# Altium project BEAGLEBONEBLACK_REV A5B.PrjPcb (part 6 of 6)

## Sheet P10_HDMI Framer.SchDoc
size 386 x 246 mm
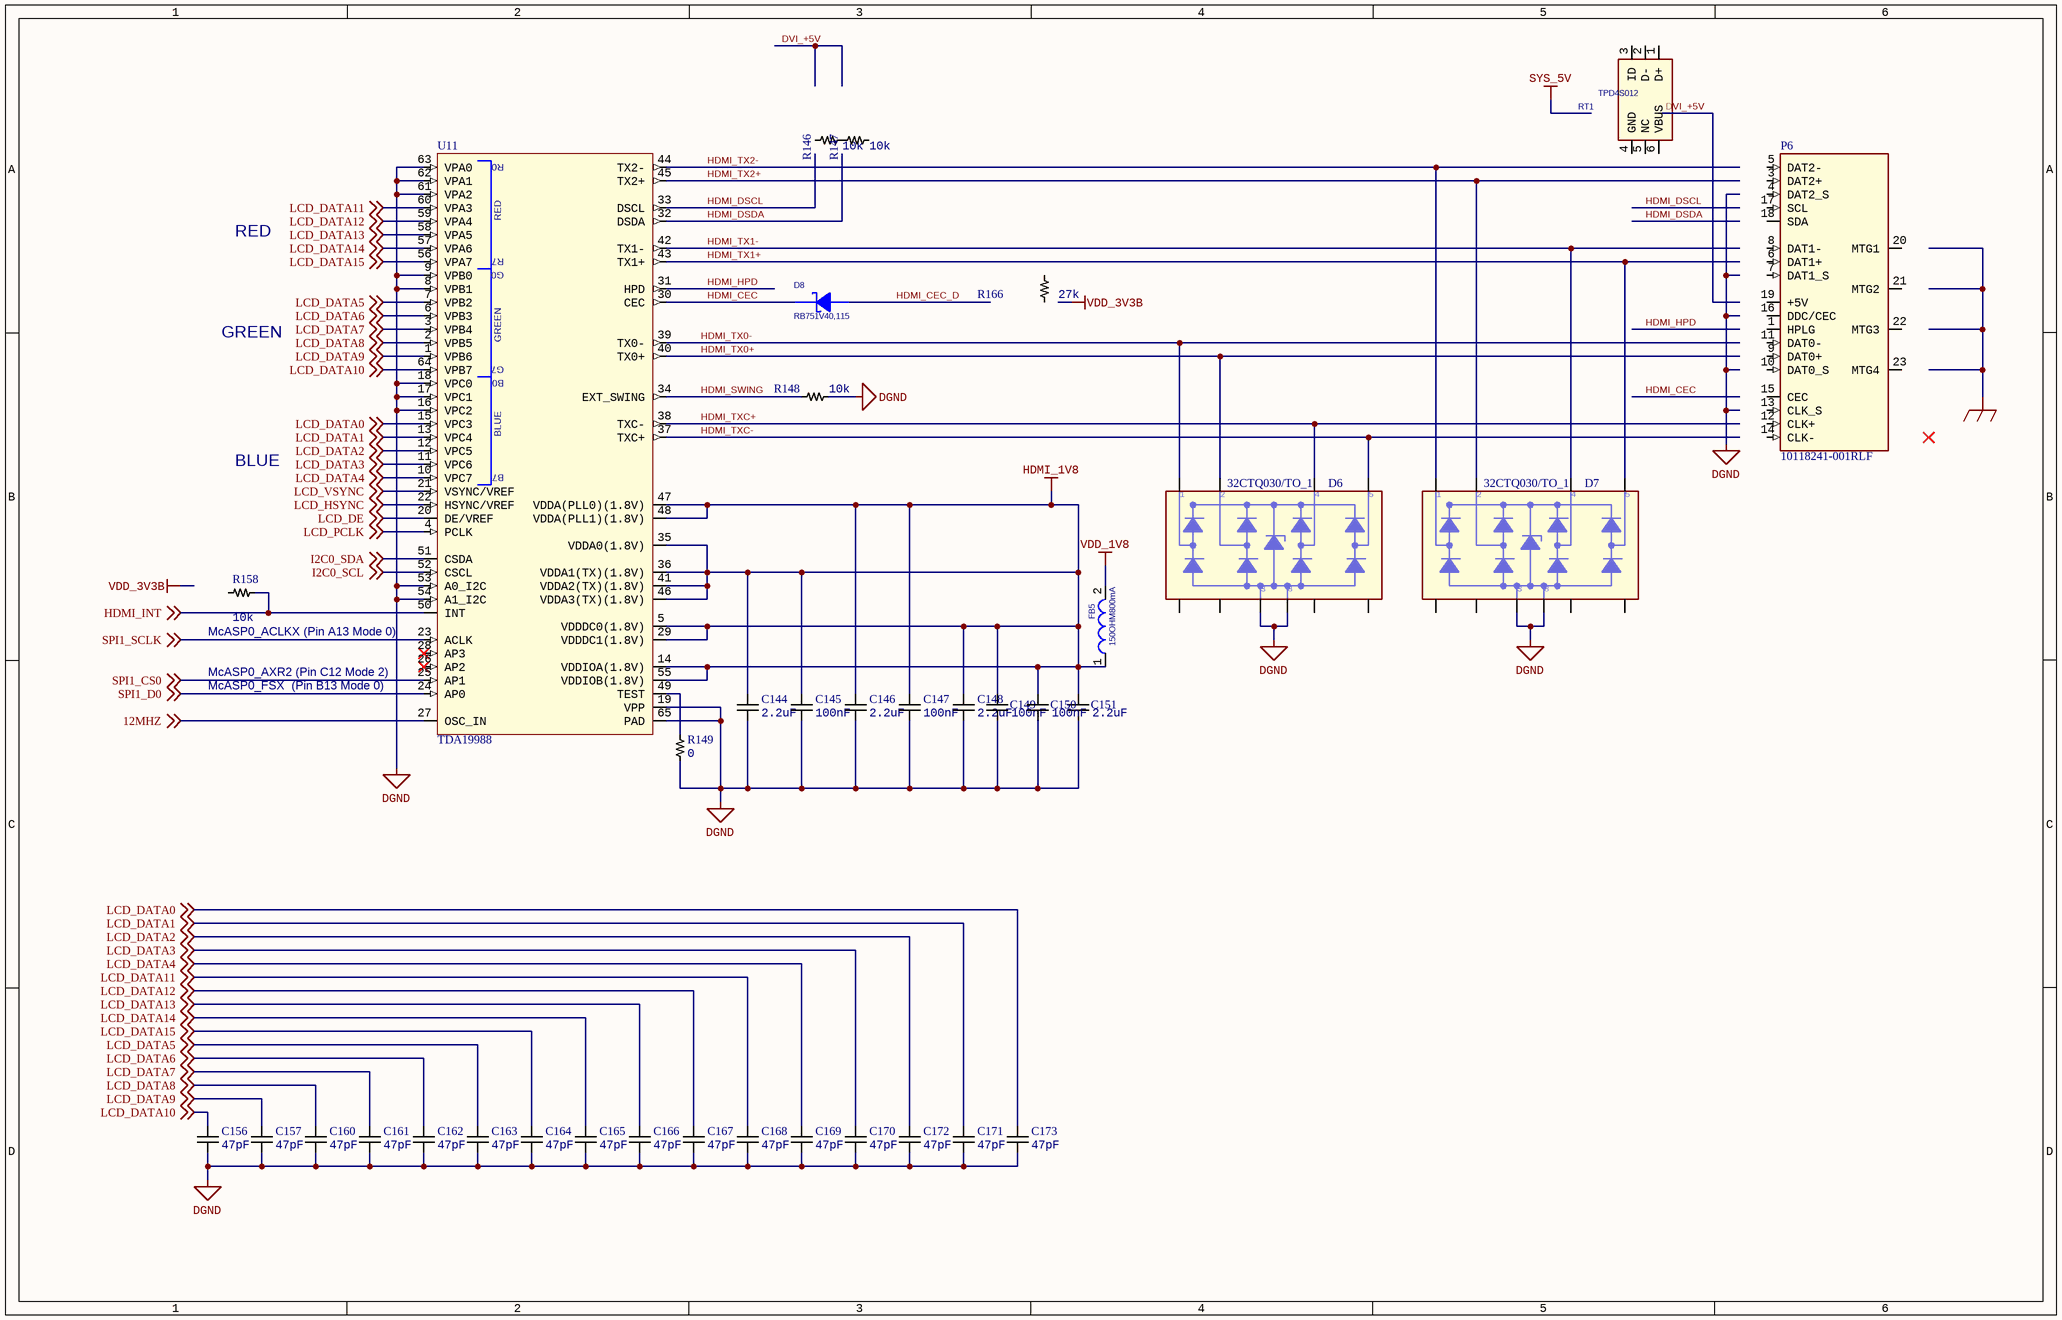
[diagram p8: P10_HDMI Framer.SchDoc]

### Parts
(Parts that share a designator on the sheet are numbered #1, #2 ... from top to bottom, then left to right.)
C144#1  Capacitance: 2.2uF  [CAP0402]  (hidden comment: C1005X5R0J225K050BC)
C145#1  Capacitance: 100nF  [CAP0402]  (hidden comment: C0402C104K4RACTU)
C146#1  Capacitance: 2.2uF  [CAP0402]  (hidden comment: C1005X5R0J225K050BC)
C147  Capacitance: 100nF  [CAP0402]  (hidden comment: C0402C104K4RACTU)
C148  Capacitance: 2.2uF  [CAP0402]  (hidden comment: C1005X5R0J225K050BC)
C149  Capacitance: 100nF  [CAP0402]  (hidden comment: C0402C104K4RACTU)
C150  Capacitance: 100nF  [CAP0402]  (hidden comment: C0402C104K4RACTU)
C151  Capacitance: 2.2uF  [CAP0402]  (hidden comment: C1005X5R0J225K050BC)
C156  Capacitance: 47pF  [CAP0402]  (hidden comment: CC0402JRNPO9BN470)
C157  Capacitance: 47pF  [CAP0402]  (hidden comment: CC0402JRNPO9BN470)
C160  Capacitance: 47pF  [CAP0402]  (hidden comment: CC0402JRNPO9BN470)
C161  Capacitance: 47pF  [CAP0402]  (hidden comment: CC0402JRNPO9BN470)
C162  Capacitance: 47pF  [CAP0402]  (hidden comment: CC0402JRNPO9BN470)
C163  Capacitance: 47pF  [CAP0402]  (hidden comment: CC0402JRNPO9BN470)
C164  Capacitance: 47pF  [CAP0402]  (hidden comment: CC0402JRNPO9BN470)
C165  Capacitance: 47pF  [CAP0402]  (hidden comment: CC0402JRNPO9BN470)
C166  Capacitance: 47pF  [CAP0402]  (hidden comment: CC0402JRNPO9BN470)
C167  Capacitance: 47pF  [CAP0402]  (hidden comment: CC0402JRNPO9BN470)
C168  Capacitance: 47pF  [CAP0402]  (hidden comment: CC0402JRNPO9BN470)
C169  Capacitance: 47pF  [CAP0402]  (hidden comment: CC0402JRNPO9BN470)
C170  Capacitance: 47pF  [CAP0402]  (hidden comment: CC0402JRNPO9BN470)
C171  Capacitance: 47pF  [CAP0402]  (hidden comment: CC0402JRNPO9BN470)
C172  Capacitance: 47pF  [CAP0402]  (hidden comment: CC0402JRNPO9BN470)
C173  Capacitance: 47pF  [CAP0402]  (hidden comment: CC0402JRNPO9BN470)
D6  32CTQ030/TO_1  [TSSOP10]
D7  32CTQ030/TO_1  [TSSOP10]
D8  RB751V40,115  [SOD323]
FB5  150OHM800mA  [FB0805]
P6#1  10118241-001RLF  [CONN19_HDMI]
R146  Resistance: 10k  [RES0402]  (hidden comment: RC0402FR-0710KL)
R147  Resistance: 10k  [RES0402]  (hidden comment: RC0402FR-0710KL)
R148  Resistance: 10k  [RES0402]  (hidden comment: RC0402FR-0710KL)
R149  Resistance: 0  [RES0402]  (hidden comment: RC0402JR-070RL)
R158  Resistance: 10k  [RES0402]  (hidden comment: RC0402FR-0710KL)
R166  Resistance: 27k  [RES0402]  (hidden comment: RC0402FR-0727KL)
RT1  TPD4S012  [U_6_DRY]
U11  TDA19988  [HVQFN-64]

### Nets
DGND: C144#1.2 C145#1.2 C146#1.2 C147.2 C148.2 C149.2 C150.2 C151.2 C156.2 C157.2 C160.2 C161.2 C162.2 C163.2 C164.2 C165.2 C166.2 C167.2 C168.2 C169.2 C170.2 C171.2 C172.2 C173.2 D6.3 D6.8 D7.3 D7.8 R148.2 R149.2 U11.8(VPB1) U11.9(VPB0) U11.16(VPC2) U11.17(VPC1) U11.18(VPC0) U11.19(VPP) U11.53(A0_I2C) U11.54(A1_I2C) U11.61(VPA2) U11.62(VPA1) U11.63(VPA0) U11.65(PAD)
HDMI_1V8: C144#1.1 C145#1.1 C146#1.1 C147.1 C148.1 C149.1 C150.1 C151.1 FB5.1 U11.5(VDDDC0(1.8V)) U11.14(VDDIOA(1.8V)) U11.29(VDDDC1(1.8V)) U11.35(VDDA0(1.8V)) U11.36(VDDA1(TX)(1.8V)) U11.41(VDDA2(TX)(1.8V)) U11.46(VDDA3(TX)(1.8V)) U11.47(VDDA(PLL0)(1.8V)) U11.48(VDDA(PLL1)(1.8V)) U11.55(VDDIOB(1.8V))
VDD_1V8: FB5.2
12MHZ: U11.27(OSC_IN) ; off-sheet 12MHZ
HDMI_CEC: D8.1(C) U11.30(CEC)
HDMI_CEC_D: D8.2(A)
HDMI_DSCL: U11.33(DSCL)
HDMI_DSDA: U11.32(DSDA)
HDMI_HPD: U11.31(HPD)
HDMI_INT: R158.2 U11.50(INT) ; off-sheet HDMI_INT
HDMI_SWING: R148.1 U11.34(EXT_SWING)
HDMI_TX0+: D6.2 U11.40(TX0+)
HDMI_TX0-: D6.1 U11.39(TX0-)
HDMI_TX1+: D7.5 U11.43(TX1+)
HDMI_TX1-: D7.4 U11.42(TX1-)
HDMI_TX2+: D7.2 U11.45(TX2+)
HDMI_TX2-: D7.1 U11.44(TX2-)
HDMI_TXC+: D6.4 U11.38(TXC-)
HDMI_TXC-: D6.5 U11.37(TXC+)
I2C0_SCL: U11.52(CSCL) ; off-sheet I2C0_SCL
I2C0_SDA: U11.51(CSDA) ; off-sheet I2C0_SDA
LCD_DATA0: C173.1 U11.15(VPC3) ; off-sheet LCD_DATA0  [project net SYS_BOOT0]
LCD_DATA1: C171.1 U11.13(VPC4) ; off-sheet LCD_DATA1  [project net SYS_BOOT1]
LCD_DATA2: C172.1 U11.12(VPC5) ; off-sheet LCD_DATA2  [project net SYS_BOOT2]
LCD_DATA3: C170.1 U11.11(VPC6) ; off-sheet LCD_DATA3  [project net SYS_BOOT3]
LCD_DATA4: C169.1 U11.10(VPC7) ; off-sheet LCD_DATA4  [project net SYS_BOOT4]
LCD_DATA5: C163.1 U11.7(VPB2) ; off-sheet LCD_DATA5  [project net SYS_BOOT5]
LCD_DATA6: C162.1 U11.6(VPB3) ; off-sheet LCD_DATA6  [project net SYS_BOOT6]
LCD_DATA7: C161.1 U11.3(VPB4) ; off-sheet LCD_DATA7  [project net SYS_BOOT7]
LCD_DATA8: C160.1 U11.2(VPB5) ; off-sheet LCD_DATA8  [project net SYS_BOOT8]
LCD_DATA9: C157.1 U11.1(VPB6) ; off-sheet LCD_DATA9  [project net SYS_BOOT9]
LCD_DATA10: C156.1 U11.64(VPB7) ; off-sheet LCD_DATA10  [project net SYS_BOOT10]
LCD_DATA11: C168.1 U11.60(VPA3) ; off-sheet LCD_DATA11  [project net SYS_BOOT11]
LCD_DATA12: C167.1 U11.59(VPA4) ; off-sheet LCD_DATA12  [project net SYS_BOOT12]
LCD_DATA13: C166.1 U11.58(VPA5) ; off-sheet LCD_DATA13  [project net SYS_BOOT13]
LCD_DATA14: C165.1 U11.57(VPA6) ; off-sheet LCD_DATA14  [project net SYS_BOOT14]
LCD_DATA15: C164.1 U11.56(VPA7) ; off-sheet LCD_DATA15  [project net SYS_BOOT15]
LCD_DE: U11.20(DE/VREF) ; off-sheet LCD_DE
LCD_HSYNC: U11.22(HSYNC/VREF) ; off-sheet LCD_HSYNC
LCD_PCLK: U11.4(PCLK) ; off-sheet LCD_PCLK
LCD_VSYNC: U11.21(VSYNC/VREF) ; off-sheet LCD_VSYNC
SPI1_CS0: U11.25(AP1) ; off-sheet SPI1_CS0
SPI1_D0: U11.24(AP0) ; off-sheet SPI1_D0
SPI1_SCLK: U11.23(ACLK) ; off-sheet SPI1_SCLK
NetR146_1: R146.1 R147.2
NetR149_1: R149.1 U11.49(TEST)

Not connected (* = marked no-connect by the designer): D6 6 7 9 10; D7 6 7 9 10; P6#1 1(HPLG) 3(DAT2+) 4(DAT2_S) 5(DAT2-) 6(DAT1+) 7(DAT1_S) 8(DAT1-) 9(DAT0+) 10(DAT0_S) 11(DAT0-) 12(CLK+) 13(CLK_S) 14(CLK-) 15(CEC) 16(DDC/CEC) 17(SCL) 18(SDA) 19(+5V) 20(MTG1) 21(MTG2) 22(MTG3) 23(MTG4); R146 2; R147 1; R158 1; R166 1 2; RT1 1(D+) 2(D-) 3(ID) 4(GND) 5(NC) 6(VBUS); U11 26(AP2)* 28(AP3)*

### Notes on the sheet
- RED
- GREEN
- BLUE
- McASP0_ACLKX (Pin A13 Mode 0)
- McASP0_AXR2 (Pin C12 Mode 2)
- McASP0_FSX  (Pin B13 Mode 0)
- (in symbol TDA19988) R0; RED; R7; G0; GREEN; G7; B0; BLUE; B7

### Library data of the parts
C144#1 C146#1 C148 C151 = CAP_2.2uF: MLCC 2.2uF 0402 SMD; Manufacturer: TDK; Dielectric Material: Ceramic; Tolerance: 10%; Dielectric: X5R; Voltage Rating: 6.3V; Supplier 1: Digi-Key; Manufacturer Part Number: C1005X5R0J225K050BC; Stock 1: 256055; Pricing 1: 1=0.20000, 10=0.13800, 100=0.07010, 500=0.04794, 1000=0.04240, 2500=0.04056, 5000=0.03687 (USD); RoHS: Yes; Mount: Surface Mount; Case/Package: 0402; Number of Pins: 2; Weight: 2.3E-05oz; Case Code (Metric): 1005; Case Code (Imperial): 0402; Min Operating Temperature: -55°C; Max Operating Temperature: 85°C; Packaging: Tape and Reel; Voltage Rating (DC): 6.3V; Termination: SMD/SMT; Package Quantity: 1; Composition: Ceramic; Voltage: 6.3V; Length: 1mm; Height: 0.5mm; Width: 0.02inch; Depth: 0.5mm; Thickness: 0.022inch; Radiation Hardening: No; Lead Free: Lead Free; REACH SVHC: No SVHC; ComponentLink7Description: Datasheet; ComponentLink7URL: https://product.tdk.com/info/en/catalog/datasheets/mlcc_commercial_general_en.pdf?ref_disty=digikey
C145#1 C147 C149 C150 = CAP_100nF: as C107-C117 on sheet P07_DDR3 Memory; Supplier 1: Digi-Key; Manufacturer Part Number: C0402C104K4RACTU; Stock 1: 6512243; Pricing 1: 1=0.10000, 10=0.04200, 100=0.01860, 500=0.01328, 1000=0.01044, 2500=0.00949, 5000=0.00873 (USD); RoHS: Yes; Mount: Surface Mount; Case/Package: 0402; Case Code (Imperial): 0402; Case Code (Metric): 1005; Contact Plating: Tin,Matte; Min Operating Temperature: -55°C; Max Operating Temperature: 125°C; Packaging: Tape and Reel; Package Quantity: 10000; Voltage Rating: 16V; Termination: SMD/SMT; Length: 1mm; Height: 0.5mm; Width: 0.5mm; Depth: 0.5mm; Radiation Hardening: No; ComponentLink2URL: https://datasheet.ciiva.com/18192/getdatasheetpartid-385384-18192412.pdf?src-supplier=Verical; ComponentLink2Description: Datasheet; Supplier Part Number 1: 399-3521-1-ND
C156 C157 C160-C173 = CAP_47pF: MLCC 47pF 0402 SMD; Manufacturer: Yageo; Dielectric Material: Ceramic; Tolerance: 5%; Dielectric: C0G; Voltage: 50V; Insulation Resistance: 100GR; Supplier 1: Digi-Key; Manufacturer Part Number: CC0402JRNPO9BN470; Stock 1: 2538955; Pricing 1: 1=0.10000, 10=0.02100, 100=0.00940, 500=0.00668, 1000=0.00525, 2500=0.00478, 5000=0.00439 (USD); RoHS: Yes; Mount: Surface Mount; Case/Package: 0402; Number of Pins: 2; Weight: 2.3E-05oz; Case Code (Metric): 1005; Case Code (Imperial): 0402; Min Operating Temperature: -55°C; Max Operating Temperature: 125°C; Voltage Rating: 50V; Package Quantity: 1; Packaging: Tape and Reel; Voltage Rating (DC): 50V; Termination: SMD/SMT; Composition: Ceramic; Length: 1mm; Height: 0.5mm; Depth: 0.5mm; Width: 0.02inch; Thickness: 0.022inch; Radiation Hardening: No; REACH SVHC: No SVHC; Lead Free: Lead Free; ComponentLink1URL: https://datasheet.ciiva.com/161/mlccorderingcode-161492.pdf?src-supplier=Digi-Key; ComponentLink1Description: https://datasheet.ciiva.com/161/mlccorderingcode-161492.pdf?src-supplier=Digi-Key; ComponentLink2URL: https://datasheet.ciiva.com/161/mlccorderingcode-161493.pdf?src-supplier=Digi-Key; ComponentLink2Description: https://datasheet.ciiva.com/161/mlccorderingcode-161493.pdf?src-supplier=Digi-Key; ComponentLink3URL: https://datasheet.ciiva.com/8033/1443161-8033637.pdf?src-supplier=Element14; ComponentLink3Description: https://datasheet.ciiva.com/8033/1443161-8033637.pdf?src-supplier=Element14; ComponentLink4URL: https://datasheet.ciiva.com/161/mlccorderingcode-161494.pdf?src-supplier=Digi-Key; ComponentLink4Description: https://datasheet.ciiva.com/161/mlccorderingcode-161494.pdf?src-supplier=Digi-Key; ComponentLink5URL: https://datasheet.ciiva.com/8033/1443161-8033638.pdf?src-supplier=Element14; ComponentLink5Description: https://datasheet.ciiva.com/8033/1443161-8033638.pdf?src-supplier=Element14; ComponentLink6URL: https://datasheet.ciiva.com/17437/upy-gp-np0-16v-to-50v-8-17437546.pdf?src-supplier=Avnet+Europe; ComponentLink6Description: https://datasheet.ciiva.com/17437/upy-gp-np0-16v-to-50v-8-17437546.pdf?src-supplier=Avnet+Europe; ComponentLink7URL: https://datasheet.ciiva.com/28450/1443161-28450267.pdf?src-supplier=Element14; ComponentLink7Description: https://datasheet.ciiva.com/28450/1443161-28450267.pdf?src-supplier=Element14
D8 = Zener: DIODE SCHOTTKY 40V 120MA SOD323; Manufacturer: NXP Semiconductors; Current - Average Rectified (Io): 120mA (DC); Voltage - Forward (Vf) (Max) @ If: 370mV @ 1mA; Speed: Small Signal =< 200mA (Io), Any Speed; Current - Reverse Leakage @ Vr: 500nA @ 30V; Capacitance @ Vr, F: 2pF @ 1V, 1MHz; Supplier 1: Digi-Key; Supplier Part Number 1: 568-8119-6-ND; Manufacturer Part Number: RB751V40,115; RoHS: RoHS Compliant; Category: Discrete Semiconductor Products; Stock 1: 5326; Pricing 1: 1=0.29, 10=0.26, 25=0.1872, 100=0.1456, 250=0.09152, 500=0.07798, 1000=0.05313 (USD); Diode Type: Schottky; Voltage - DC Reverse (Vr) (Max): 40V; Reverse Recovery Time (trr): -; Mounting Type: Surface Mount; Package / Case: SC-76, SOD-323; Supplier Device Package: SOD-323; Packaging: Digi-Reel®; ComponentLink1URL: http://www.nxp.com/documents/data_sheet/RB751_SER.pdf; ComponentLink1Description: http://www.nxp.com/documents/data_sheet/RB751_SER.pdf
FB5 = IND: FERRITE 800MA 150 OHM 0805 SMD; Manufacturer: Laird-Signal Integrity Products; Manufacturer Part Number: LI0805H151R-10; Impedance @ Frequency: 150 Ohm @ 100MHz; DC Resistance (DCR): 150 mOhm Max; Filter Type: Differential Mode - Single; Supplier 1: Digi-Key; Supplier Part Number 1: 240-2384-6-ND; RoHS: RoHS Compliant; Category: Filters; Stock 1: 10144; Pricing 1: 1=0.1, 10=0.07, 25=0.064, 50=0.0574, 100=0.0421, 250=0.03064, 500=0.02808, 1000=0.02424 (USD); Current Rating: 800mA; Package / Case: 0805 (2012 Metric); Mounting Type: Surface Mount; Packaging: Digi-Reel®; Height (Max): 0.043" (1.10mm); Size / Dimension: 0.079" L x 0.049" W (2.00mm x 1.25mm); ComponentLink1URL: http://www.lairdtech.com/WorkArea/linkit.aspx?LinkIdentifier=id&ItemID=4912; ComponentLink1Description: http://www.lairdtech.com/WorkArea/linkit.aspx?LinkIdentifier=id&ItemID=4912
P6#1 = Micro HDMI: CONN HDMI RECPT 19POS SMT R/A; Manufacturer: FCI; Number of Contacts: 19; Gender: Receptacle; Supplier 1: Digi-Key; Supplier Part Number 1: 609-4615-6-ND; Manufacturer Part Number: 10118241-001RLF; RoHS: RoHS Compliant; Category: Connectors, Interconnects; Stock 1: 6779; Pricing 1: 1=1.34, 10=1.174, 25=1.1052, 50=1.059, 100=1.013, 250=0.92092 (USD); Connector Type: HDMI; Specifications: -; Mounting Type: Surface Mount, Right Angle, Horizontal; Features: Shielded, Solder Retention; Packaging: Digi-Reel®; Ingress Protection: -; ComponentLink1URL: http://portal.fciconnect.com/Comergent//fci/drawing/10118241.pdf; ComponentLink1Description: http://portal.fciconnect.com/Comergent//fci/drawing/10118241.pdf
R146-R148 R158 = RES_10k: Resistor 10kOhm 0402 SMD; Manufacturer: Yageo; Temperature Coefficient: 100ppm/°C; Tolerance: 1%; Voltage Rating (DC): 50V; Power Rating: 62.5mW; Supplier 1: Digi-Key; Manufacturer Part Number: RC0402FR-0710KL; RoHS: Yes; Stock 1: 72891652; Pricing 1: 1=0.10000, 10=0.01500, 100=0.00600, 1000=0.00270, 2500=0.00235, 5000=0.00194 (USD); Composition: Thick Film; Height: 0.32mm; Number of Terminations: 2; Packaging: Tape and Reel; ComponentLink1URL: https://datasheet.ciiva.com/7660/38568-7660787.pdf?src-supplier=Element14; ComponentLink1Description: https://datasheet.ciiva.com/7660/38568-7660787.pdf?src-supplier=Element14; Case/Package: 0402; Number of Pins: 2; Case Code (Imperial): 0402; Case Code (Metric): 1005; Min Operating Temperature: -55°C; Max Operating Temperature: 155°C; Voltage Rating: 50V; Termination: SMD/SMT; Military Standard: Not; Working Voltage: 50V; Length: 1mm; Width: 0.5mm; Depth: 0.5mm; Lead Pitch: 0.2mm; REACH SVHC: No SVHC; Lead Free: Lead Free; ComponentLink2URL: https://datasheet.ciiva.com/7983/1018594-7983486.pdf?src-supplier=Element14; ComponentLink2Description: https://datasheet.ciiva.com/7983/1018594-7983486.pdf?src-supplier=Element14; ComponentLink3URL: https://datasheet.ciiva.com/7849/1784430-7849813.pdf?src-supplier=Element14; ComponentLink3Description: https://datasheet.ciiva.com/7849/1784430-7849813.pdf?src-supplier=Element14; ComponentLink4URL: https://datasheet.ciiva.com/7849/1686128-7849814.pdf?src-supplier=Element14; ComponentLink4Description: https://datasheet.ciiva.com/7849/1686128-7849814.pdf?src-supplier=Element14; ComponentLink5URL: https://datasheet.ciiva.com/7849/1784430-7849815.pdf?src-supplier=Element14; ComponentLink5Description: https://datasheet.ciiva.com/7849/1784430-7849815.pdf?src-supplier=Element14; ComponentLink6URL: https://datasheet.ciiva.com/22747/1018594-22747512.pdf?src-supplier=Element14; ComponentLink6Description: https://datasheet.ciiva.com/22747/1018594-22747512.pdf?src-supplier=Element14; ComponentLink7URL: https://datasheet.ciiva.com/12667/pyu-rc0402-51-rohs-l-6-r-12667067.pdf?src-supplier=Mouser; ComponentLink7Description: https://datasheet.ciiva.com/12667/pyu-rc0402-51-rohs-l-6-r-12667067.pdf?src-supplier=Mouser
R149 = RES_0: Resistor 0Ohm 0402 SMD; Manufacturer: Yageo; Temperature Coefficient: 200ppm/°C; Tolerance: 5%; Power Rating: 62.5mW; Voltage Rating: 50V; Max Power Dissipation: 63mW; Supplier 1: Digi-Key; Supplier Part Number 1: 311-0.0JRCT-ND; Manufacturer Part Number: RC0402JR-070RL; RoHS: Yes; Stock 1: 68160806; Pricing 1: 1=0.10000, 10=0.01300, 25=0.00920, 50=0.00700, 100=0.00510, 250=0.00392, 500=0.00312, 1000=0.00230, 5000=0.00165 (USD); Composition: Thick Film; Features: Moisture Resistant; Height: 0.016inch; Number of Terminations: 2; Packaging: Tape and Reel; ComponentLink1URL: https://www.digikey.com/product-detail/en/yageo/RC0402JR-070RL/311-0.0JRCT-ND/729353; ComponentLink1Description: Digikey; Case/Package: 0402; Contact Plating: Tin,Matte; Case Code (Metric): 1005; Case Code (Imperial): 0402; Min Operating Temperature: -55°C; Max Operating Temperature: 155°C; Termination: SMD/SMT; Package Quantity: 1; Military Standard: Not; Length: 1mm; Width: 0.02inch; Depth: 0.5mm; Radiation Hardening: No; Lead Free: Lead Free; REACH SVHC: Unknown; ComponentLink2Description: Datasheet; ComponentLink2URL: https://www.yageo.com/upload/media/product/productsearch/datasheet/rchip/PYu-RC_Group_51_RoHS_L_10.pdf
R166 = RES_27k: Resistor 27kOhm 0402 SMD; Manufacturer: Yageo; Temperature Coefficient: 100ppm/°C; Tolerance: 1%; Power Rating: 63mW; Voltage Rating: 50V; Supplier 1: Digi-Key; Manufacturer Part Number: RC0402FR-0727KL; RoHS: Yes; Stock 1: 2429807; Pricing 1: 1=0.10000, 10=0.01600, 100=0.00640, 1000=0.00289, 2500=0.00251, 5000=0.00207 (USD); Composition: Thick Film; Features: Moisture Resistant; Height: 0.016inch; Number of Terminations: 2; Packaging: Tape and Reel; ComponentLink1URL: https://datasheet.ciiva.com/11819/0900766b80c66297-11819497.pdf?src-supplier=RSComponents; ComponentLink1Description: https://datasheet.ciiva.com/11819/0900766b80c66297-11819497.pdf?src-supplier=RSComponents; Case/Package: 0402; Case Code (Imperial): 0402; Case Code (Metric): 1005; Min Operating Temperature: -55°C; Max Operating Temperature: 155°C; Package Quantity: 10000; Termination: SMD/SMT; Military Standard: Not; Max Power Dissipation: 63mW; Length: 1mm; Width: 0.02inch; Depth: 0.5mm; REACH SVHC: Unknown; Lead Free: Lead Free; ComponentLink2URL: https://datasheet.ciiva.com/7849/1018594-7849925.pdf?src-supplier=Element14; ComponentLink2Description: https://datasheet.ciiva.com/7849/1018594-7849925.pdf?src-supplier=Element14; ComponentLink3URL: https://datasheet.ciiva.com/2453/pyu-r-int-thick-7-2453562.pdf?src-supplier=Digi-Key; ComponentLink3Description: https://datasheet.ciiva.com/2453/pyu-r-int-thick-7-2453562.pdf?src-supplier=Digi-Key; ComponentLink4URL: https://datasheet.ciiva.com/16772/pyu-rc0402-51-rohs-l-6-r-16772092.pdf?src-supplier=Future+Electronics; ComponentLink4Description: https://datasheet.ciiva.com/16772/pyu-rc0402-51-rohs-l-6-r-16772092.pdf?src-supplier=Future+Electronics
RT1 = PROT_TPD4S012: ESD 4channel USB Interface; Manufacturer: Texas Instruments; Manufacturer Part Number: TPD4S012DRYR; Mfr: TI; MfrNum: TPD4S012DRY; TIIntPartnumber: 1A0233; Vendor: Digikey; Cost100: 0.76; Cost10K: 0.23; Power (Watts): 60W; Number of Circuits: 4; Supplier 1: Digi-Key; Supplier Part Number 1: 296-24244-6-ND; RoHS: RoHS Compliant; Category: Circuit Protection; Stock 1: 7978; Pricing 1: 1=0.78, 10=0.682, 25=0.6028, 100=0.2552, 250=0.25044, 500=0.2457, 750=0.24097 (USD); Package / Case: 6-UFDFN; Packaging: Digi-Reel®; ComponentLink1URL: http://www.ti.com/lit/ds/symlink/tpd4s012.pdf; ComponentLink1Description: http://www.ti.com/lit/ds/symlink/tpd4s012.pdf; PartName: TPD4S012; Voltage - Working: -; Voltage - Clamping: -; Technology: Mixed Technology; Applications: USB; Supplier Device Package: 6-SON (1.45x1)
U11 = TDA19988: IC HDMI TRANSMITTER 64-HVQFN; Manufacturer: NXP Semiconductors; Manufacturer Part Number: TDA19988AHN/C1,551; Supplier 1: Digi-Key; Supplier Part Number 1: TDA19988AHN/C1,551-ND; RoHS: RoHS Compliant; Category: Integrated Circuits (ICs); Stock 1: 0; Pricing 1: 260=4.59 (USD); Type: HDMI Transmitter; Applications: Set-Top Boxes; Mounting Type: Surface Mount; Package / Case: 64-VFQFN Exposed Pad; Supplier Device Package: 64-HVQFN (9x9); Packaging: Tray; ComponentLink1Description: Digikey; ComponentLink1URL: https://www.digikey.com/product-detail/en/nxp-usa-inc/TDA19988BHN-C1557/568-12059-ND/2780352; ComponentLink2Description: Datasheet; ComponentLink2URL: https://media.digikey.com/pdf/Data%20Sheets/NXP%20PDFs/TDA19988_DS_21_july_2011.pdf

## Sheet P11_Exp Conn, uSD, and .SchDoc
size A
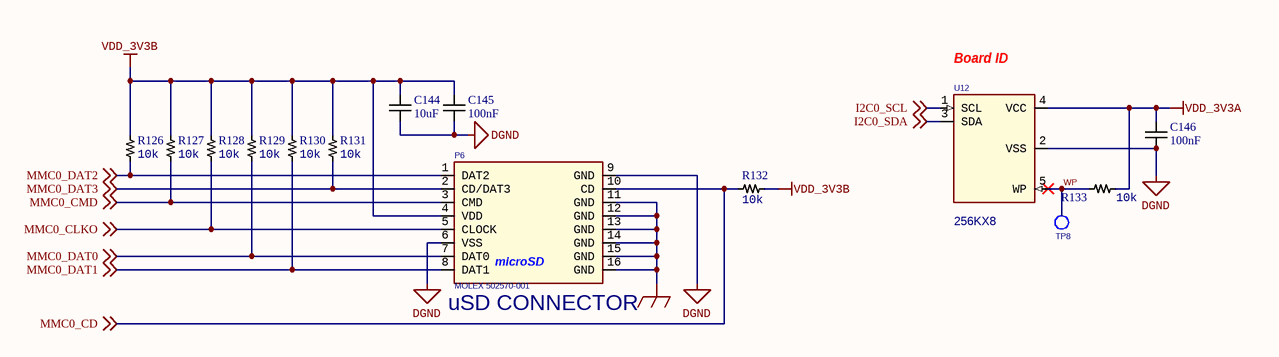
[diagram p9: P11_Exp Conn, uSD, and .SchDoc]

### Parts
(Parts that share a designator on the sheet are numbered #1, #2 ... from top to bottom, then left to right.)
C144#2  Capacitance: 10uF  [CAP0805]  (hidden comment: C2012X6S1A106K085AC)
C145#2  Capacitance: 100nF  [CAP0402]  (hidden comment: C0402C104K4RACTU)
C146#2  Capacitance: 100nF  [CAP0402]  (hidden comment: C0402C104K4RACTU)
P6#2  MOLEX 502570-001  [SD-MICRO-SCHA5B0300]
R126  Resistance: 10k  [RES0402]  (hidden comment: RC0402FR-0710KL)
R127  Resistance: 10k  [RES0402]  (hidden comment: RC0402FR-0710KL)
R128  Resistance: 10k  [RES0402]  (hidden comment: RC0402FR-0710KL)
R129  Resistance: 10k  [RES0402]  (hidden comment: RC0402FR-0710KL)
R130  Resistance: 10k  [RES0402]  (hidden comment: RC0402FR-0710KL)
R131  Resistance: 10k  [RES0402]  (hidden comment: RC0402FR-0710KL)
R132  Resistance: 10k  [RES0402]  (hidden comment: RC0402FR-0710KL)
R133  Resistance: 10k  [RES0402]  (hidden comment: RC0402FR-0710KL)
TP8#2  TESTPT1  [tp1-8040]  (value not drawn)  (no BOM)
U12#2  24LC32A  [SOT-23-5]  (value not drawn)

### Nets
DGND: C144#2.2 C145#2.2 C146#2.2 P6#2.6(VSS) P6#2.9(GND) U12#2.2(VSS)
GND_EARTH: P6#2.11(GND) P6#2.12(GND) P6#2.13(GND) P6#2.14(GND) P6#2.15(GND) P6#2.16(GND)
VDD_3V3A: C146#2.1 R133.2 U12#2.4(VCC)
VDD_3V3B: C144#2.1 C145#2.1 P6#2.4(VDD) R126.2 R127.2 R128.2 R129.2 R130.2 R131.2 R132.1
I2C0_SCL: U12#2.1(SCL) ; off-sheet I2C0_SCL
I2C0_SDA: U12#2.3(SDA) ; off-sheet I2C0_SDA
MMC0_CD: P6#2.10(CD) R132.2 ; off-sheet MMC0_CD
MMC0_CLKO: P6#2.5(CLOCK) R128.1 ; off-sheet MMC0_CLKO
MMC0_CMD: P6#2.3(CMD) R127.1 ; off-sheet MMC0_CMD
MMC0_DAT0: P6#2.7(DAT0) R129.1 ; off-sheet MMC0_DAT0
MMC0_DAT1: P6#2.8(DAT1) R130.1 ; off-sheet MMC0_DAT1
MMC0_DAT2: P6#2.1(DAT2) R126.1 ; off-sheet MMC0_DAT2
MMC0_DAT3: P6#2.2(CD/DAT3) R131.1 ; off-sheet MMC0_DAT3
WP: R133.1 TP8#2.1(TP) U12#2.5(WP)

### Notes on the sheet
- (near U12#2) Board ID
- (near U12#2) 256KX8
- (near P6#2) uSD CONNECTOR
- (in symbol microSD_CONN_2) microSD

### Library data of the parts
C144#2 = CAP_10uF: MLCC 10uF 0805 SMD; Manufacturer: TDK; Tolerance: 10%; Dielectric Material: Ceramic; Voltage Rating: 10V; Dielectric: X6S; Manufacturer Part Number: C2012X6S1A106K085AC; Packaging: Tape and Reel; Pricing 1: 1=0.30000, 10=0.20500, 100=0.11610, 500=0.08198, 1000=0.07173 (USD); RoHS: Yes; Stock 1: 46852; Supplier 1: Digi-Key; Supplier Part Number 1: 445-7613-1-ND; Mount: Surface Mount; Case/Package: 0805; Weight: 0.000194oz; Case Code (Metric): 2012; Case Code (Imperial): 0805; Min Operating Temperature: -55°C; Max Operating Temperature: 105°C; Termination: SMD/SMT; Package Quantity: 4000; Voltage Rating (DC): 10V; Composition: Ceramic; Length: 2mm; Height: 1.25mm; Depth: 1.25mm; Width: 0.049inch; Thickness: 0.037inch; REACH SVHC: No SVHC; Lead Free: Lead Free; ComponentLink3URL: https://datasheet.ciiva.com/6290/tdkmlcccaprange-6290501.pdf?src-supplier=Digi-Key; ComponentLink3Description: Datasheet
C145#2 C146#2 = CAP_100nF: as C107-C117 on sheet P07_DDR3 Memory; Supplier 1: Digi-Key; Supplier Part Number 1: 399-3521-1-ND; Manufacturer Part Number: C0402C104K4RACTU; RoHS: Yes; Stock 1: 6512243; Pricing 1: 1=0.10000, 10=0.04200, 100=0.01860, 500=0.01328, 1000=0.01044, 2500=0.00949, 5000=0.00873 (USD); Packaging: Tape and Reel; Mount: Surface Mount; Case/Package: 0402; Case Code (Imperial): 0402; Case Code (Metric): 1005; Contact Plating: Tin,Matte; Min Operating Temperature: -55°C; Max Operating Temperature: 125°C; Package Quantity: 10000; Voltage Rating: 16V; Termination: SMD/SMT; Length: 1mm; Height: 0.5mm; Width: 0.5mm; Depth: 0.5mm; Radiation Hardening: No; ComponentLink2URL: https://datasheet.ciiva.com/18192/getdatasheetpartid-385384-18192412.pdf?src-supplier=Verical; ComponentLink2Description: Datasheet
P6#2 = microSD_CONN_2: CONN MICRO SD R/A PUSH-PUSH SMD; Manufacturer: Molex Inc; Manufacturer Part Number: 5025700893; Card Type: Secure Digital - microSD™ TransFlash; Number of Positions: 10 (8 + 2); Connector Type: Connector and Ejector; Insertion, Removal Method: Push In, Push Out; Supplier 1: Digi-Key; Supplier Part Number 1: WM19093TR-ND; RoHS: RoHS Compliant; Category: Connectors, Interconnects; Stock 1: 16900; Pricing 1: 1300=2.16645, 2600=2.01703, 6500=1.94233 (USD); Ejector Side: -; Mounting Type: Surface Mount, Right Angle; Features: Switch; Height Above Board: 0.071" (1.80mm); Mounting Feature: Normal, Standard - Top; Packaging: Tape & Reel (TR); Contact Finish: Gold; Contact Finish Thickness: 20µin (0.51µm); ComponentLink1URL: http://www.molex.com/pdm_docs/sd/5025700893_sd.pdf; ComponentLink1Description: http://www.molex.com/pdm_docs/sd/5025700893_sd.pdf
R126-R133 = RES_10k: as R146 on sheet P10_HDMI Framer; ComponentLink1Description: https://datasheet.ciiva.com/7660/38568-7660787.pdf?src-supplier=Element14; ComponentLink1URL: https://datasheet.ciiva.com/7660/38568-7660787.pdf?src-supplier=Element14; Composition: Thick Film; Height: 0.32mm; Manufacturer Part Number: RC0402FR-0710KL; Number of Terminations: 2; Packaging: Tape and Reel; Pricing 1: 1=0.10000, 10=0.01500, 100=0.00600, 1000=0.00270, 2500=0.00235, 5000=0.00194 (USD); RoHS: Yes; Stock 1: 72891652; Supplier 1: Digi-Key; Case/Package: 0402; Number of Pins: 2; Case Code (Imperial): 0402; Case Code (Metric): 1005; Min Operating Temperature: -55°C; Max Operating Temperature: 155°C; Voltage Rating: 50V; Termination: SMD/SMT; Military Standard: Not; Working Voltage: 50V; Length: 1mm; Width: 0.5mm; Depth: 0.5mm; Lead Pitch: 0.2mm; REACH SVHC: No SVHC; Lead Free: Lead Free; ComponentLink2URL: https://datasheet.ciiva.com/7983/1018594-7983486.pdf?src-supplier=Element14; ComponentLink2Description: https://datasheet.ciiva.com/7983/1018594-7983486.pdf?src-supplier=Element14; ComponentLink3URL: https://datasheet.ciiva.com/7849/1784430-7849813.pdf?src-supplier=Element14; ComponentLink3Description: https://datasheet.ciiva.com/7849/1784430-7849813.pdf?src-supplier=Element14; ComponentLink4URL: https://datasheet.ciiva.com/7849/1686128-7849814.pdf?src-supplier=Element14; ComponentLink4Description: https://datasheet.ciiva.com/7849/1686128-7849814.pdf?src-supplier=Element14; ComponentLink5URL: https://datasheet.ciiva.com/7849/1784430-7849815.pdf?src-supplier=Element14; ComponentLink5Description: https://datasheet.ciiva.com/7849/1784430-7849815.pdf?src-supplier=Element14; ComponentLink6URL: https://datasheet.ciiva.com/22747/1018594-22747512.pdf?src-supplier=Element14; ComponentLink6Description: https://datasheet.ciiva.com/22747/1018594-22747512.pdf?src-supplier=Element14; ComponentLink7URL: https://datasheet.ciiva.com/12667/pyu-rc0402-51-rohs-l-6-r-12667067.pdf?src-supplier=Mouser; ComponentLink7Description: https://datasheet.ciiva.com/12667/pyu-rc0402-51-rohs-l-6-r-12667067.pdf?src-supplier=Mouser
U12#2 = 24LC32A: IC EEPROM 32KBIT 400KHZ SOT23-5; Manufacturer: Microchip Technology; Manufacturer Part Number: 24LC32AT-I/OT; Format - Memory: EEPROMs - Serial; Memory Size: 32K (4K x 8); Interface: I²C, 2-Wire Serial; Voltage - Supply: 2.5 V ~ 5.5 V; Supplier 1: Digi-Key; Supplier Part Number 1: 24LC32AT-I/OTDKR-ND; RoHS: RoHS Compliant; Category: Integrated Circuits (ICs); Stock 1: 8694; Pricing 1: 1=0.5, 10=0.32, 25=0.31, 100=0.3 (USD); Memory Type: EEPROM; Speed: 400kHz; Operating Temperature: -40°C ~ 85°C; Package / Case: SC-74A, SOT-753; Supplier Device Package: SOT-23-5; Packaging: Digi-Reel®; ComponentLink1URL: http://ww1.microchip.com/downloads/en/DeviceDoc/21713M.pdf; ComponentLink1Description: http://ww1.microchip.com/downloads/en/DeviceDoc/21713M.pdf

## Nets that join several sheets
DDR_VREF: P03_Processor 1 of 3, JTAG Header (C28.1 IC1.J4), P07_DDR3 Memory (6 pins)
DGND: P02_Power Management (31 pins), P03_Processor 1 of 3, JTAG Header (20 pins), P04_Processor 2 or 3, USB and Serial (17 pins), P05_Processor Page 3 of 3 (111 pins), P06_LED, Config, & Button (18 pins), P07_DDR3 Memory (42 pins), P08_eMMC (19 pins), P09_Ethernet (25 pins), P10_HDMI Framer (42 pins), P11_Exp Conn, uSD, and  (6 pins)
GND_EARTH: P02_Power Management (MTG1.1 MTG2.1 MTG3.1 MTG4.1), P04_Processor 2 or 3, USB and Serial (6 pins), P09_Ethernet (J7.13 J7.14 R92#2.1), P11_Exp Conn, uSD, and  (6 pins)
GNDA_ADC: P04_Processor 2 or 3, USB and Serial (C31.2 C32.2 C33.2 U5.A9), P05_Processor Page 3 of 3 (C93.2 FB3.1)
SYS_5V: P02_Power Management (14 pins), P04_Processor 2 or 3, USB and Serial (C17#2.1 U8.2 U8.3), P08_eMMC (C124#2.1 IC11.2 IC11.3)
USB_DC: P02_Power Management (C1.1 U2.12), P04_Processor 2 or 3, USB and Serial (C36.1 P4.1 R159.1 U10.6)
VDCDC2: P02_Power Management (C12.2 L2.2 U2.24), P05_Processor Page 3 of 3 (11 pins)
VDCDC3: P02_Power Management (C11.2 L3.2 U2.29), P05_Processor Page 3 of 3 (37 pins)
VDD_1V8: P02_Power Management (C14.2 R9.1 U2.40), P05_Processor Page 3 of 3 (9 pins), P10_HDMI Framer (FB5.2)
VDD_3V3A: P02_Power Management (5 pins), P03_Processor 1 of 3, JTAG Header (9 pins), P04_Processor 2 or 3, USB and Serial (R52.1), P05_Processor Page 3 of 3 (42 pins), P06_LED, Config, & Button (16 pins), P08_eMMC (R75#2.1), P11_Exp Conn, uSD, and  (C146#2.1 R133.2 U12#2.4)
VDD_3V3B: P02_Power Management (C20.1 R11.2 U4.3), P03_Processor 1 of 3, JTAG Header (C29.1 P2.5 R23.2 R24.1), P04_Processor 2 or 3, USB and Serial (C155.2 R163.2 U15.7 U15.8), P08_eMMC (25 pins), P09_Ethernet (7 pins), P11_Exp Conn, uSD, and  (10 pins)
VDD_ADC: P04_Processor 2 or 3, USB and Serial (R27.2), P05_Processor Page 3 of 3 (C93.1 FB2.1)
VDDS: P02_Power Management (R8.2 R9.2), P05_Processor Page 3 of 3 (13 pins)
VDDS_DDR: P02_Power Management (C9.2 R6.2), P05_Processor Page 3 of 3 (16 pins), P07_DDR3 Memory (36 pins)
VRTC: P02_Power Management (C16.2 R5.2), P04_Processor 2 or 3, USB and Serial (R26.2), P05_Processor Page 3 of 3 (C105.1)
12MHZ: P03_Processor 1 of 3, JTAG Header (R21.1), P10_HDMI Framer (U11.27)
DDR_A0: P03_Processor 1 of 3, JTAG Header (IC1.F3), P07_DDR3 Memory (U12#1.N3)
DDR_A1: P03_Processor 1 of 3, JTAG Header (IC1.H1), P07_DDR3 Memory (U12#1.P7)
DDR_A2: P03_Processor 1 of 3, JTAG Header (IC1.E4), P07_DDR3 Memory (U12#1.P3)
DDR_A3: P03_Processor 1 of 3, JTAG Header (IC1.C3), P07_DDR3 Memory (U12#1.N2)
DDR_A4: P03_Processor 1 of 3, JTAG Header (IC1.C2), P07_DDR3 Memory (U12#1.P8)
DDR_A5: P03_Processor 1 of 3, JTAG Header (IC1.B1), P07_DDR3 Memory (U12#1.P2)
DDR_A6: P03_Processor 1 of 3, JTAG Header (IC1.D5), P07_DDR3 Memory (U12#1.R8)
DDR_A7: P03_Processor 1 of 3, JTAG Header (IC1.E2), P07_DDR3 Memory (U12#1.R2)
DDR_A8: P03_Processor 1 of 3, JTAG Header (IC1.D4), P07_DDR3 Memory (U12#1.T8)
DDR_A9: P03_Processor 1 of 3, JTAG Header (IC1.C1), P07_DDR3 Memory (U12#1.R3)
DDR_A10: P03_Processor 1 of 3, JTAG Header (IC1.F4), P07_DDR3 Memory (U12#1.L7)
DDR_A11: P03_Processor 1 of 3, JTAG Header (IC1.F2), P07_DDR3 Memory (U12#1.R7)
DDR_A12: P03_Processor 1 of 3, JTAG Header (IC1.E3), P07_DDR3 Memory (U12#1.N7)
DDR_A13: P03_Processor 1 of 3, JTAG Header (IC1.H3), P07_DDR3 Memory (U12#1.T3)
DDR_A14: P03_Processor 1 of 3, JTAG Header (IC1.H4), P07_DDR3 Memory (U12#1.T7)
DDR_A15: P03_Processor 1 of 3, JTAG Header (IC1.D3), P07_DDR3 Memory (U12#1.M7)
DDR_BA0: P03_Processor 1 of 3, JTAG Header (IC1.C4), P07_DDR3 Memory (U12#1.M2)
DDR_BA1: P03_Processor 1 of 3, JTAG Header (IC1.E1), P07_DDR3 Memory (U12#1.N8)
DDR_BA2: P03_Processor 1 of 3, JTAG Header (IC1.B3), P07_DDR3 Memory (U12#1.M3)
DDR_CASn: P03_Processor 1 of 3, JTAG Header (IC1.F1), P07_DDR3 Memory (U12#1.K3)
DDR_CKE: P03_Processor 1 of 3, JTAG Header (IC1.G3), P07_DDR3 Memory (R96#1.1 U12#1.K9)
DDR_CLK: P03_Processor 1 of 3, JTAG Header (IC1.D2), P07_DDR3 Memory (U12#1.J7)
DDR_CLKn: P03_Processor 1 of 3, JTAG Header (IC1.D1), P07_DDR3 Memory (U12#1.K7)
DDR_CSn: P03_Processor 1 of 3, JTAG Header (IC1.H2), P07_DDR3 Memory (U12#1.L2)
DDR_D0: P03_Processor 1 of 3, JTAG Header (IC1.M3), P07_DDR3 Memory (U12#1.E3)
DDR_D1: P03_Processor 1 of 3, JTAG Header (IC1.M4), P07_DDR3 Memory (U12#1.F7)
DDR_D2: P03_Processor 1 of 3, JTAG Header (IC1.N1), P07_DDR3 Memory (U12#1.F2)
DDR_D3: P03_Processor 1 of 3, JTAG Header (IC1.N2), P07_DDR3 Memory (U12#1.F8)
DDR_D4: P03_Processor 1 of 3, JTAG Header (IC1.N3), P07_DDR3 Memory (U12#1.H3)
DDR_D5: P03_Processor 1 of 3, JTAG Header (IC1.N4), P07_DDR3 Memory (U12#1.H8)
DDR_D6: P03_Processor 1 of 3, JTAG Header (IC1.P3), P07_DDR3 Memory (U12#1.G2)
DDR_D7: P03_Processor 1 of 3, JTAG Header (IC1.P4), P07_DDR3 Memory (U12#1.H7)
DDR_D8: P03_Processor 1 of 3, JTAG Header (IC1.J1), P07_DDR3 Memory (U12#1.D7)
DDR_D9: P03_Processor 1 of 3, JTAG Header (IC1.K1), P07_DDR3 Memory (U12#1.C3)
DDR_D10: P03_Processor 1 of 3, JTAG Header (IC1.K2), P07_DDR3 Memory (U12#1.C8)
DDR_D11: P03_Processor 1 of 3, JTAG Header (IC1.K3), P07_DDR3 Memory (U12#1.C2)
DDR_D12: P03_Processor 1 of 3, JTAG Header (IC1.K4), P07_DDR3 Memory (U12#1.A7)
DDR_D13: P03_Processor 1 of 3, JTAG Header (IC1.L3), P07_DDR3 Memory (U12#1.A2)
DDR_D14: P03_Processor 1 of 3, JTAG Header (IC1.L4), P07_DDR3 Memory (U12#1.B8)
DDR_D15: P03_Processor 1 of 3, JTAG Header (IC1.M1), P07_DDR3 Memory (U12#1.A3)
DDR_DQM0: P03_Processor 1 of 3, JTAG Header (IC1.M2), P07_DDR3 Memory (U12#1.E7)
DDR_DQM1: P03_Processor 1 of 3, JTAG Header (IC1.J2), P07_DDR3 Memory (U12#1.D3)
DDR_DQS0: P03_Processor 1 of 3, JTAG Header (IC1.P1), P07_DDR3 Memory (U12#1.F3)
DDR_DQS1: P03_Processor 1 of 3, JTAG Header (IC1.L1), P07_DDR3 Memory (U12#1.C7)
DDR_DQSN0: P03_Processor 1 of 3, JTAG Header (IC1.P2), P07_DDR3 Memory (U12#1.G3)
DDR_DQSN1: P03_Processor 1 of 3, JTAG Header (IC1.L2), P07_DDR3 Memory (U12#1.B7)
DDR_ODT: P03_Processor 1 of 3, JTAG Header (IC1.G1), P07_DDR3 Memory (U12#1.K1)
DDR_RASn: P03_Processor 1 of 3, JTAG Header (IC1.G4), P07_DDR3 Memory (U12#1.J3)
DDR_RESETn: P03_Processor 1 of 3, JTAG Header (IC1.G2), P07_DDR3 Memory (R97#1.1 U12#1.T2)
DDR_WEn: P03_Processor 1 of 3, JTAG Header (IC1.B2), P07_DDR3 Memory (U12#1.L3)
eMMC_RSTn: P03_Processor 1 of 3, JTAG Header (R162.2), P08_eMMC (IC12.K5 R87#2.1)
GPIO3_20: P03_Processor 1 of 3, JTAG Header (R20.1), P04_Processor 2 or 3, USB and Serial (U5.D13)
GPIO3_21: P03_Processor 1 of 3, JTAG Header (R167.2), P04_Processor 2 or 3, USB and Serial (U5.A14)
HDMI_INT: P03_Processor 1 of 3, JTAG Header (IC5.U16), P10_HDMI Framer (R158.2 U11.50)
I2C0_SCL: P02_Power Management (R3.1 U2.28), P04_Processor 2 or 3, USB and Serial (U5.C16), P10_HDMI Framer (U11.52), P11_Exp Conn, uSD, and  (U12#2.1)
I2C0_SDA: P02_Power Management (R4.1 U2.27), P04_Processor 2 or 3, USB and Serial (U5.C17), P10_HDMI Framer (U11.51), P11_Exp Conn, uSD, and  (U12#2.3)
LCD_DE: P04_Processor 2 or 3, USB and Serial (R48.2), P10_HDMI Framer (U11.20)
LCD_HSYNC: P04_Processor 2 or 3, USB and Serial (R47.2), P10_HDMI Framer (U11.22)
LCD_PCLK: P04_Processor 2 or 3, USB and Serial (R45.2), P10_HDMI Framer (U11.4)
LCD_VSYNC: P04_Processor 2 or 3, USB and Serial (R46.2), P10_HDMI Framer (U11.21)
LDO_PGOOD: P02_Power Management (U2.46), P03_Processor 1 of 3, JTAG Header (IC5.B5)
MDIO_CLK: P04_Processor 2 or 3, USB and Serial (U5.M18), P09_Ethernet (IC13.17)
MDIO_DATA: P04_Processor 2 or 3, USB and Serial (U5.M17), P09_Ethernet (IC13.16 R97#2.2)
MII1_COL: P04_Processor 2 or 3, USB and Serial (U5.H16), P09_Ethernet (R114.2)
MII1_CRS_DV: P04_Processor 2 or 3, USB and Serial (U5.H17), P09_Ethernet (R115.2)
MII1_REFCLK: P04_Processor 2 or 3, USB and Serial (R28.2), P09_Ethernet (R98#2.2 R116.2)
MII1_RXCLK: P04_Processor 2 or 3, USB and Serial (U5.L18), P09_Ethernet (R104.2)
MII1_RXD0: P04_Processor 2 or 3, USB and Serial (U5.M16), P09_Ethernet (R102.2)
MII1_RXD1: P04_Processor 2 or 3, USB and Serial (U5.L15), P09_Ethernet (R101.2)
MII1_RXD2: P04_Processor 2 or 3, USB and Serial (U5.L16), P09_Ethernet (R100#2.2)
MII1_RXD3: P04_Processor 2 or 3, USB and Serial (U5.L17), P09_Ethernet (R99#2.2)
MII1_RXDV: P04_Processor 2 or 3, USB and Serial (U5.J17), P09_Ethernet (R103.2)
MII1_RXERR: P04_Processor 2 or 3, USB and Serial (U5.J15), P09_Ethernet (R105.2)
MII1_TXCLK: P04_Processor 2 or 3, USB and Serial (U5.K18), P09_Ethernet (R108.2)
MII1_TXD0: P04_Processor 2 or 3, USB and Serial (U5.K17), P09_Ethernet (IC13.22)
MII1_TXD1: P04_Processor 2 or 3, USB and Serial (U5.K16), P09_Ethernet (IC13.23)
MII1_TXD2: P04_Processor 2 or 3, USB and Serial (U5.K15), P09_Ethernet (IC13.24)
MII1_TXD3: P04_Processor 2 or 3, USB and Serial (U5.J18), P09_Ethernet (IC13.25)
MII1_TXEN: P04_Processor 2 or 3, USB and Serial (U5.J16), P09_Ethernet (IC13.21)
MMC0_CD: P03_Processor 1 of 3, JTAG Header (P2.19), P04_Processor 2 or 3, USB and Serial (U5.C15), P11_Exp Conn, uSD, and  (P6#2.10 R132.2)
MMC0_CLKO: P03_Processor 1 of 3, JTAG Header (IC5.G17), P11_Exp Conn, uSD, and  (P6#2.5 R128.1)
MMC0_CMD: P03_Processor 1 of 3, JTAG Header (IC5.G18), P11_Exp Conn, uSD, and  (P6#2.3 R127.1)
MMC0_DAT0: P03_Processor 1 of 3, JTAG Header (IC5.G16), P11_Exp Conn, uSD, and  (P6#2.7 R129.1)
MMC0_DAT1: P03_Processor 1 of 3, JTAG Header (IC5.G15), P11_Exp Conn, uSD, and  (P6#2.8 R130.1)
MMC0_DAT2: P03_Processor 1 of 3, JTAG Header (IC5.F18), P11_Exp Conn, uSD, and  (P6#2.1 R126.1)
MMC0_DAT3: P03_Processor 1 of 3, JTAG Header (IC5.F17), P11_Exp Conn, uSD, and  (P6#2.2 R131.1)
MMC1_CLK: P03_Processor 1 of 3, JTAG Header (IC5.U9), P08_eMMC (IC12.M6 R86#2.1)
MMC1_CMD: P03_Processor 1 of 3, JTAG Header (IC5.V9), P08_eMMC (IC12.M5 R85#2.1)
MMC1_DAT0: P03_Processor 1 of 3, JTAG Header (IC5.U7), P08_eMMC (IC12.A3 R77.1)
MMC1_DAT1: P03_Processor 1 of 3, JTAG Header (IC5.V7), P08_eMMC (IC12.A4 R78.1)
MMC1_DAT2: P03_Processor 1 of 3, JTAG Header (IC5.R8), P08_eMMC (IC12.A5 R79.1)
MMC1_DAT3: P03_Processor 1 of 3, JTAG Header (IC5.T8), P08_eMMC (IC12.B2 R80#2.1)
MMC1_DAT4: P03_Processor 1 of 3, JTAG Header (IC5.U8), P08_eMMC (IC12.B3 R81#2.1)
MMC1_DAT5: P03_Processor 1 of 3, JTAG Header (IC5.V8), P08_eMMC (IC12.B4 R82#2.1)
MMC1_DAT6: P03_Processor 1 of 3, JTAG Header (IC5.R9), P08_eMMC (IC12.B5 R83#2.1)
MMC1_DAT7: P03_Processor 1 of 3, JTAG Header (IC5.T9), P08_eMMC (IC12.B6 R84#2.1)
PMIC_INT: P02_Power Management (R1.1 U2.45), P03_Processor 1 of 3, JTAG Header (IC5.B18)
PMIC_PGOOD: P02_Power Management (U2.26), P03_Processor 1 of 3, JTAG Header (IC5.B15)
PMIC_POWR_EN: P02_Power Management (U2.9), P04_Processor 2 or 3, USB and Serial (U5.C6)
SPI1_CS0: P04_Processor 2 or 3, USB and Serial (U5.C12), P10_HDMI Framer (U11.25)
SPI1_D0: P04_Processor 2 or 3, USB and Serial (U5.B13), P10_HDMI Framer (U11.24)
SPI1_SCLK: P04_Processor 2 or 3, USB and Serial (U5.A13), P10_HDMI Framer (U11.23)
SYS_BOOT0: P04_Processor 2 or 3, USB and Serial (U5.R1), P06_LED, Config, & Button (R70.1 R95#1.2), P10_HDMI Framer (C173.1 U11.15)
SYS_BOOT1: P04_Processor 2 or 3, USB and Serial (U5.R2), P06_LED, Config, & Button (R69.1 R94#1.2), P10_HDMI Framer (C171.1 U11.13)
SYS_BOOT2: P04_Processor 2 or 3, USB and Serial (U5.R3), P06_LED, Config, & Button (R68.1 R75#1.1 R93#1.2), P10_HDMI Framer (C172.1 U11.12)
SYS_BOOT3: P04_Processor 2 or 3, USB and Serial (U5.R4), P06_LED, Config, & Button (R67.1 R92#1.2), P10_HDMI Framer (C170.1 U11.11)
SYS_BOOT4: P04_Processor 2 or 3, USB and Serial (U5.T1), P06_LED, Config, & Button (R66.1 R91#1.2), P10_HDMI Framer (C169.1 U11.10)
SYS_BOOT5: P04_Processor 2 or 3, USB and Serial (U5.T2), P06_LED, Config, & Button (R65.1 R90#1.2), P10_HDMI Framer (C163.1 U11.7)
SYS_BOOT6: P04_Processor 2 or 3, USB and Serial (U5.T3), P06_LED, Config, & Button (R64.1 R89#1.2), P10_HDMI Framer (C162.1 U11.6)
SYS_BOOT7: P04_Processor 2 or 3, USB and Serial (U5.T4), P06_LED, Config, & Button (R63.1 R88#1.2), P10_HDMI Framer (C161.1 U11.3)
SYS_BOOT8: P04_Processor 2 or 3, USB and Serial (U5.U1), P06_LED, Config, & Button (R62.1 R87#1.2), P10_HDMI Framer (C160.1 U11.2)
SYS_BOOT9: P04_Processor 2 or 3, USB and Serial (U5.U2), P06_LED, Config, & Button (R61.1 R86#1.2), P10_HDMI Framer (C157.1 U11.1)
SYS_BOOT10: P04_Processor 2 or 3, USB and Serial (U5.U3), P06_LED, Config, & Button (R60.1 R85#1.2), P10_HDMI Framer (C156.1 U11.64)
SYS_BOOT11: P04_Processor 2 or 3, USB and Serial (U5.U4), P06_LED, Config, & Button (R59.1 R84#1.2), P10_HDMI Framer (C168.1 U11.60)
SYS_BOOT12: P04_Processor 2 or 3, USB and Serial (U5.V2), P06_LED, Config, & Button (R58.1 R83#1.2), P10_HDMI Framer (C167.1 U11.59)
SYS_BOOT13: P04_Processor 2 or 3, USB and Serial (U5.V3), P06_LED, Config, & Button (R57.1 R82#1.2), P10_HDMI Framer (C166.1 U11.58)
SYS_BOOT14: P04_Processor 2 or 3, USB and Serial (U5.V4), P06_LED, Config, & Button (R56.1 R81#1.2), P10_HDMI Framer (C165.1 U11.57)
SYS_BOOT15: P04_Processor 2 or 3, USB and Serial (U5.T5), P06_LED, Config, & Button (R55.1 R80#1.2), P10_HDMI Framer (C164.1 U11.56)
SYS_RESETn: P03_Processor 1 of 3, JTAG Header (7 pins), P09_Ethernet (IC13.19)
USB1_OCn: P03_Processor 1 of 3, JTAG Header (IC5.T16), P04_Processor 2 or 3, USB and Serial (R52.2 U8.5)
WAKEUP: P02_Power Management (U2.13), P04_Processor 2 or 3, USB and Serial (R26.1 U5.C5)

## Assembly variants
Default: not fitted C137 C138 C139 C140 P2 R9 R57 R58 R59 R60 R61 R62 R63 R64 R69 R70 R81 R90 R91 R92 R93 R124 R140 R141